# Altium schematic sheet FPGA - REGULATORS.SchDoc
size A3; DocumentNumber: 6; SheetNumber: 6; SheetTotal: 17
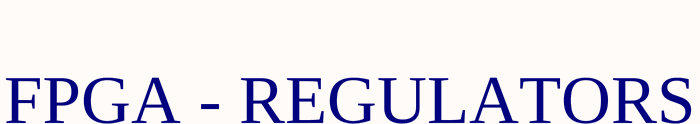
[diagram p0: FPGA - REGULATORS.SchDoc]

## Notes on the sheet
- FPGA - REGULATORS